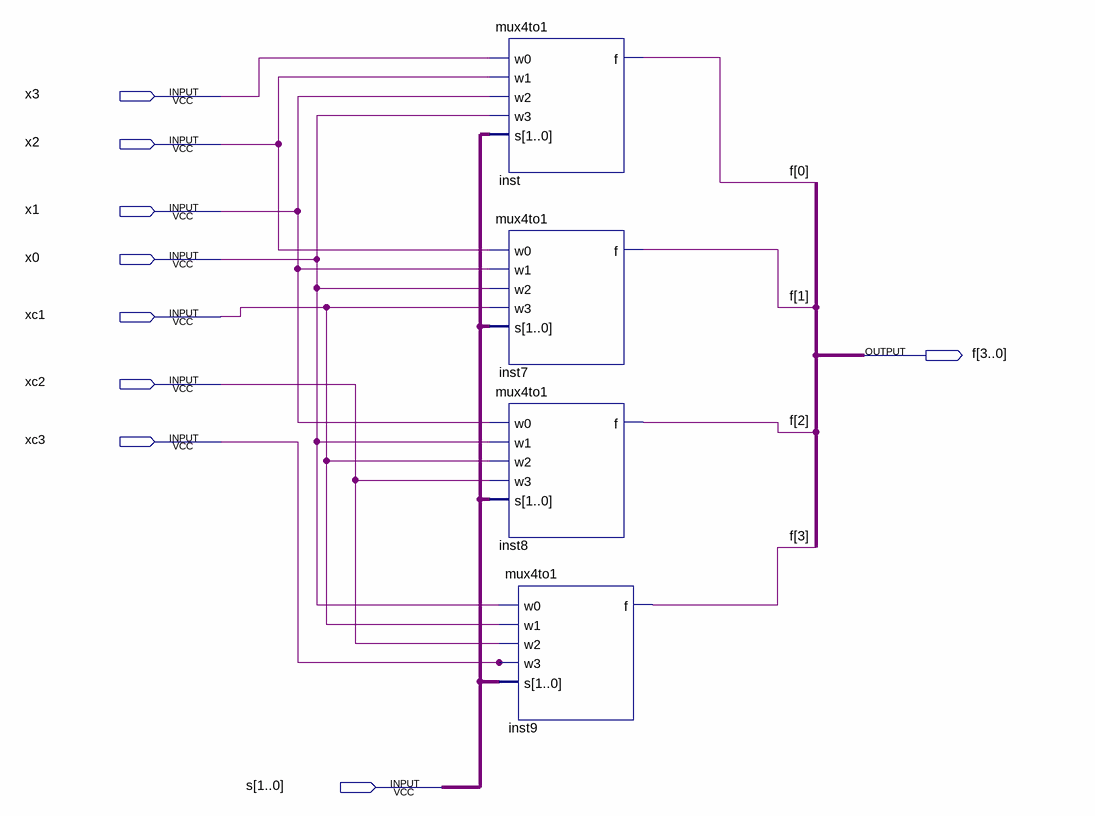
[diagram p0: schematic sheet]
// Quartus schematic shifter.bdf as structural Verilog: 4 symbols, 9 pins
module shifter (
  input  x3,
  input  x2,
  input  x1,
  input  x0,
  input  xc1,
  input  xc2,
  input  xc3,
  input  [1:0] s,
  output [3:0] f
);

  mux4to1 inst (.w0(x3), .w1(x2), .w2(x1), .w3(x0), .s(s), .f(f[0]));
  mux4to1 inst7 (.w0(x2), .w1(x1), .w2(x0), .w3(xc1), .s(s), .f(f[1]));
  mux4to1 inst8 (.w0(x1), .w1(x0), .w2(xc1), .w3(xc2), .s(s), .f(f[2]));
  mux4to1 inst9 (.w0(x0), .w1(xc1), .w2(xc2), .w3(xc3), .s(s), .f(f[3]));
endmodule
